# Altium project Ramp-generator.PrjPcb
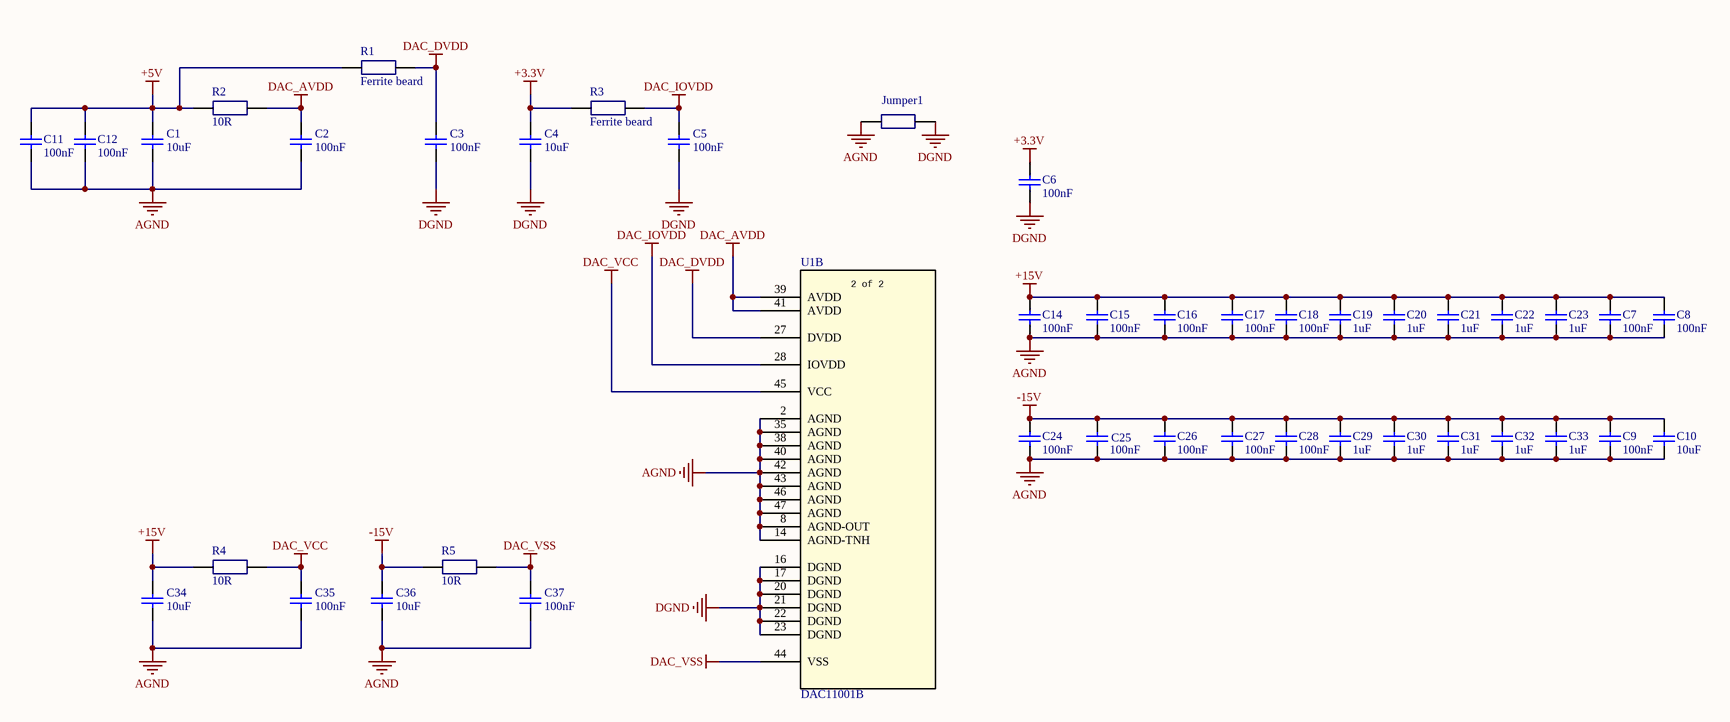
[diagram p0: shcematics.SchDoc]
2 sheets, 72 parts. Net scope: global (net labels, ports and power ports of the same name join across sheets).
Board file: 4layer_main_board.PcbDoc
Sheets:
  shcematics.SchDoc
  v2.SchDoc

## Sheet shcematics.SchDoc: Ultra-Precision low speed ramp generator for low current calibration
size A2; PageSetup: Record=PageOptions|CenterHorizontal=True|CenterVertical=True|PrintScale=0.52|XCorrection=1.00|YCorrection=1.00|PrintKind=0|BorderSize=5000000|LeftOffset=0|BottomOffset=0|Orientation=2|PaperLength=1000|PaperWidth=1000|Scale=100|PaperSource=7|PrintQuality=-3|MediaType=1|DitherType=10|PrintScaleMode=1|PaperKind=A4|PaperIndex=9

### Parts
C1  10uF  [CAP 0603]
C2  100nF  [CAP 0603]
C3  100nF  [CAP 0603]
C4  10uF  [CAP 0603]
C5  100nF  [CAP 0603]
C6  100nF  [CAP 0603]
C7  100nF  [CAP 0603]
C8  100nF  [CAP 0603]
C9  100nF  [CAP 0603]
C10  10uF  [CAP 0603]
C11  100nF  [CAP 0603]
C12  100nF  [CAP 0603]
C14  100nF  [CAP 0603]
C15  100nF  [CAP 0603]
C16  100nF  [CAP 0603]
C17  100nF  [CAP 0603]
C18  100nF  [CAP 0603]
C19  1uF  [CAP 0603]
C20  1uF  [CAP 0603]
C21  1uF  [CAP 0603]
C22  1uF  [CAP 0603]
C23  1uF  [CAP 0603]
C24  100nF  [CAP 0603]
C25  100nF  [CAP 0603]
C26  100nF  [CAP 0603]
C27  100nF  [CAP 0603]
C28  100nF  [CAP 0603]
C29  1uF  [CAP 0603]
C30  1uF  [CAP 0603]
C31  1uF  [CAP 0603]
C32  1uF  [CAP 0603]
C33  1uF  [CAP 0603]
C34  10uF  [C1206]
C35  100nF  [CAP 0603]
C36  10uF  [C1206]
C37  100nF  [CAP 0603]
Jumper1  (no value)  [0402 jumper]  (net tie, no BOM)
R1  Ferrite beard  [CC1206JRNPOBBN100]
R2  10R  [1608[0603]]
R3  Ferrite beard  [CC1206JRNPOBBN100]
R4  10R  [1608[0603]]
R5  10R  [1608[0603]]
U1  DAC11001B  [QFP_APFBR_TEX]  (part B of 2)

### Nets
+3.3V: C4.1 C6.2 R3.2
+5V: C1.1 C11.2 C12.2 R1.2 R2.2
+15V: C7.2 C8.2 C14.2 C15.2 C16.2 C17.2 C18.2 C19.2 C20.2 C21.2 C22.2 C23.2 C34.1 R4.2
-15V: C9.2 C10.2 C24.2 C25.2 C26.2 C27.2 C28.2 C29.2 C30.2 C31.2 C32.2 C33.2 C36.1 R5.2
AGND: C1.2 C2.2 C7.1 C8.1 C9.1 C10.1 C11.1 C12.1 C14.1 C15.1 C16.1 C17.1 C18.1 C19.1 C20.1 C21.1 C22.1 C23.1 C24.1 C25.1 C26.1 C27.1 C28.1 C29.1 C30.1 C31.1 C32.1 C33.1 C34.2 C35.2 C36.2 C37.2 Jumper1.2 U1.2(AGND) U1.8(AGND-OUT) U1.14(AGND-TNH) U1.35(AGND) U1.38(AGND) U1.40(AGND) U1.42(AGND) U1.43(AGND) U1.46(AGND) U1.47(AGND)
DAC_AVDD: C2.1 R2.1(A) U1.39(AVDD) U1.41(AVDD)
DAC_DVDD: C3.1 R1.1(A) U1.27(DVDD)
DAC_IOVDD: C5.1 R3.1(A) U1.28(IOVDD)
DAC_VCC: C35.1 R4.1(A) U1.45(VCC)
DAC_VSS: C37.1 R5.1(A) U1.44(VSS)
DGND: C3.2 C4.2 C5.2 C6.1 Jumper1.1(A) U1.16(DGND) U1.17(DGND) U1.20(DGND) U1.21(DGND) U1.22(DGND) U1.23(DGND)

### Notes on the sheet
- (in symbol DAC11001APFBR, part B) 2 of 2

### Library data of the parts
C1-C12 C14-C37 = Cap Semi: Capacitor (Semiconductor SIM Model); Order: CC0603KRX7R8BB104; Published: 8-Jun-2000; LatestRevisionDate: 29-May-2009; LatestRevisionNote: IPC-7351 Footprint Added.; PackageReference: C1206; Publisher: Altium Limited; PackageDescription: Chip Capacitor
  C1 C4 C10 C34 C36: Value: 10uF
  C2 C3 C5-C9 C11 C12 C14-C18 C24-C28 C35 C37: Value: 100nF
  C19-C23 C29-C33: Value: 1uF
Jumper1 = Resistor 0805: Avail: 20
R1-R5 = Resistor 0805: Order: ERA-3AEB4992V; Avail: 20
  R1 R3: Value: Ferrite beard
  R2 R4 R5: Value: 10R
U1 = DAC11001APFBR: No Description Available; Vendor: Texas Instruments; Built_By: EMA_Matt; SourceLibrary: Texas_Instruments_2020-07-20; Manufacturer_Part_Number: DAC11001APFBR; Copyright: Copyright (C) 2018 Accelerated Designs. All rights reserved; Datasheet: https://www.ti.com/lit/ds/symlink/dac11001a.pdf; RefDes: RefDes; Type: DEV

## Sheet v2.SchDoc
size A3
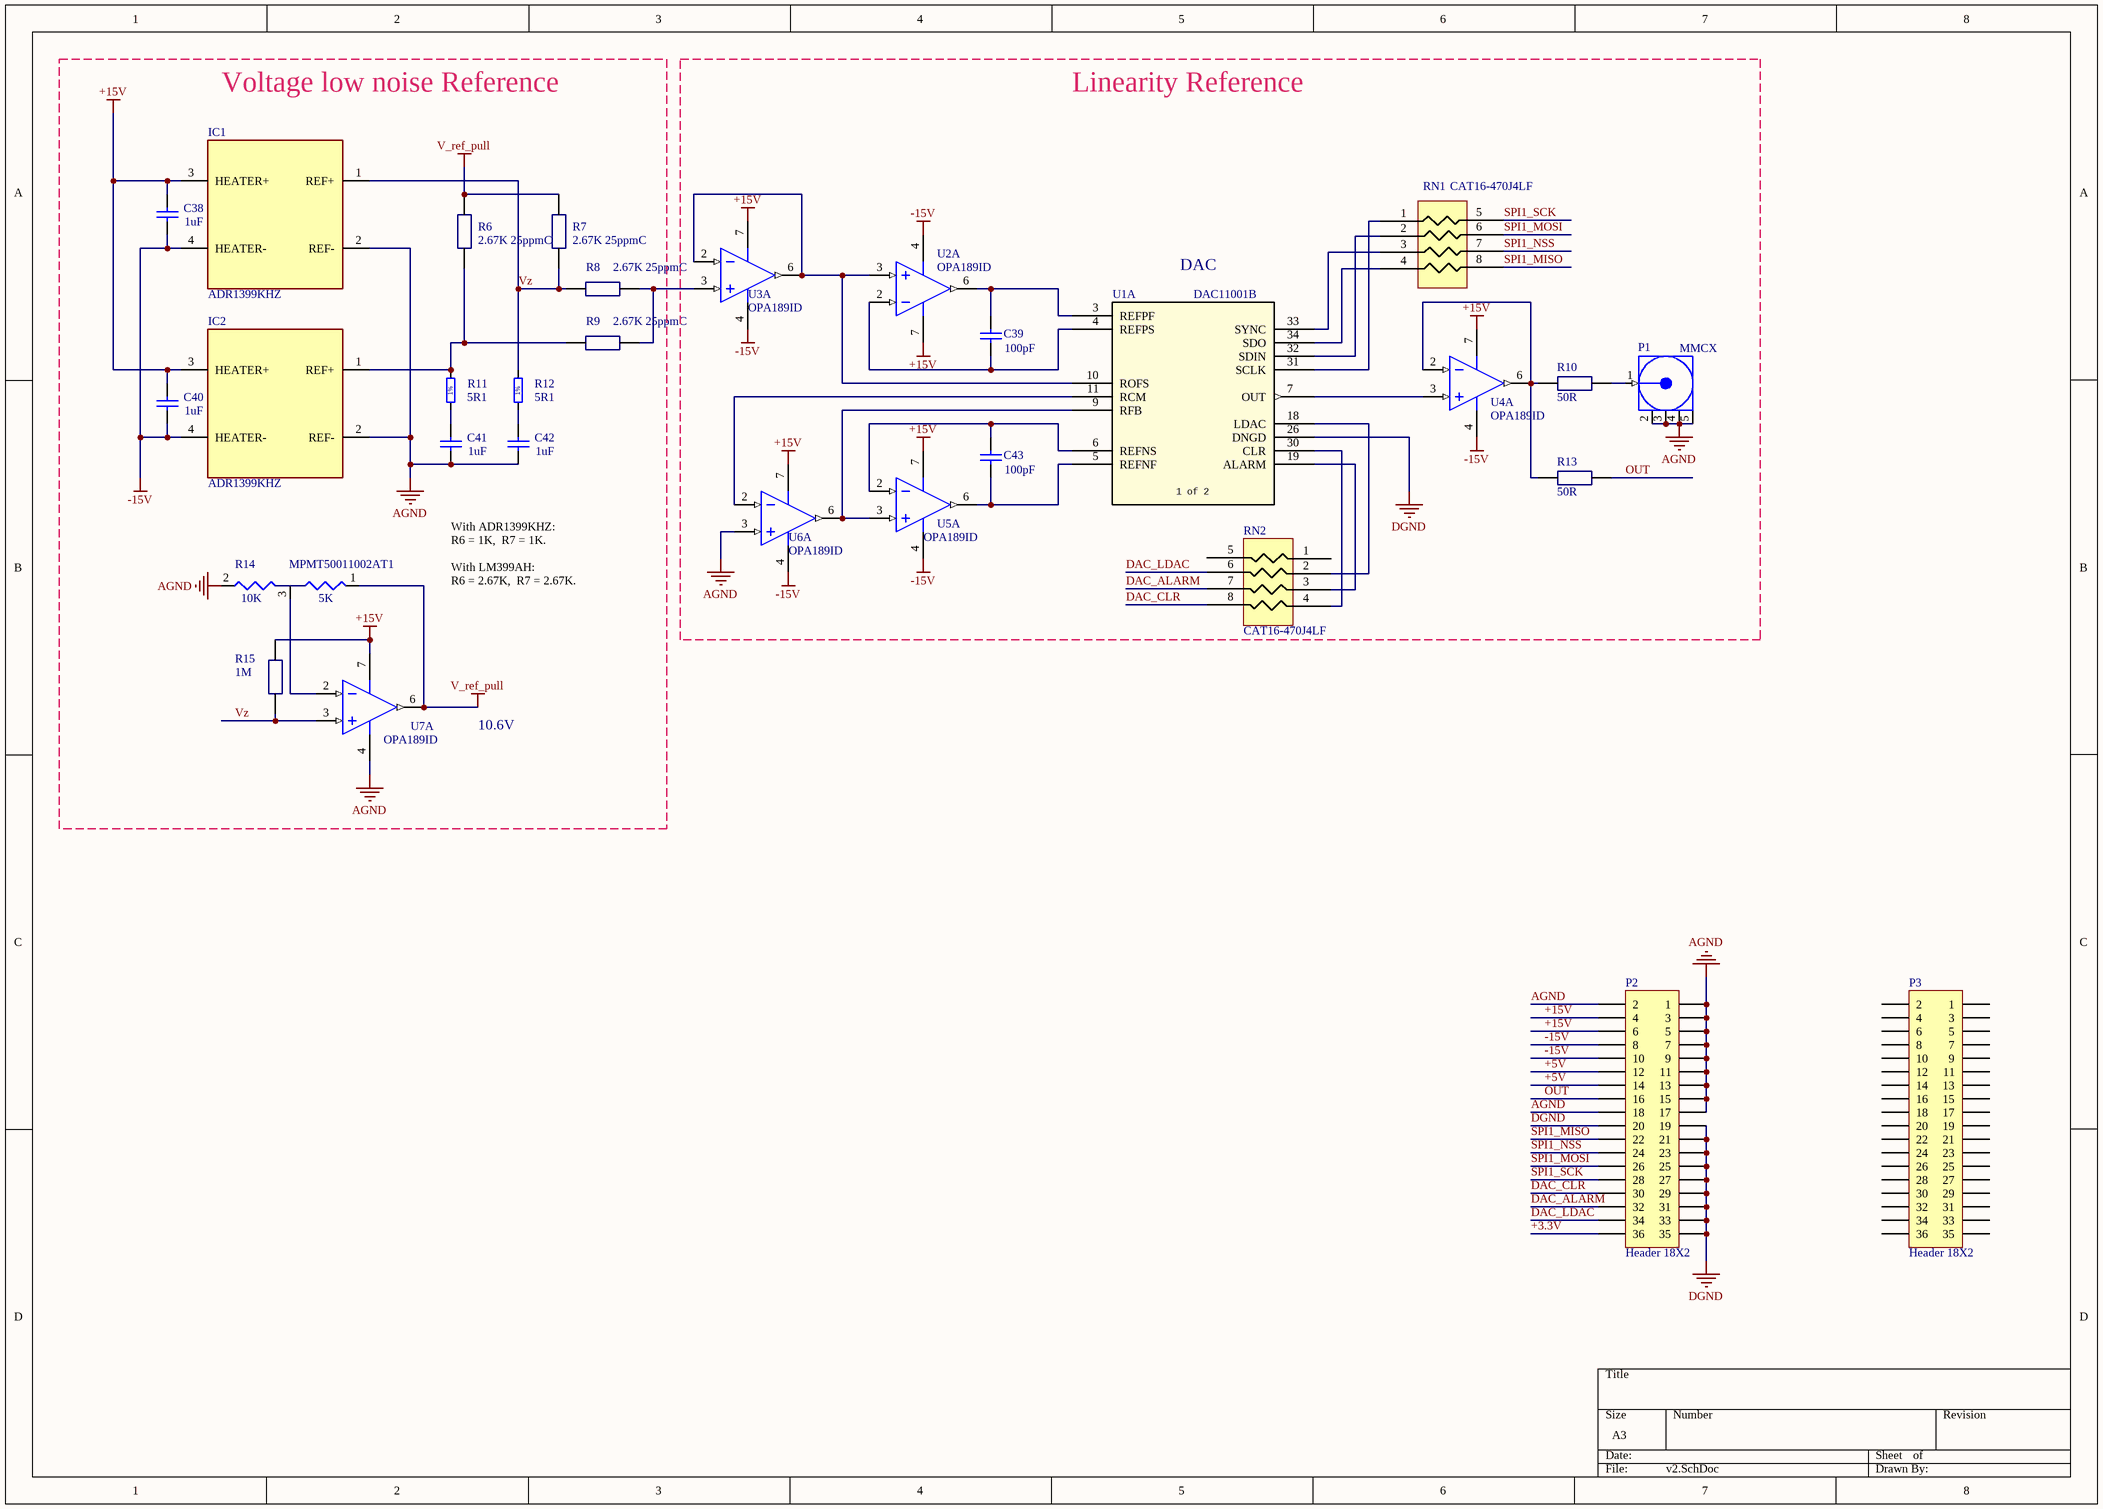
[diagram p1: v2.SchDoc]

### Parts
C38  1uF  [CAPC3216X140N]
C39  value 100pF  [0402]  (hidden comment: Cap Semi)
C40  1uF  [CAPC3216X140N]
C41  1uF  [CAPC3216X140N]
C42  1uF  [CAPC3216X140N]
C43  value 100pF  [0402]  (hidden comment: Cap Semi)
IC1  ADR1399KHZ  [ADR1399KHZ]
IC2  ADR1399KHZ  [ADR1399KHZ]
P1  MMCX  [MMCX2.54-V5]
P2  Header 18X2  [HDR2X18]
P3  Header 18X2  [HDR2X18]
R6  2.67K 25ppmC  [1608[0603]]
R7  2.67K 25ppmC  [1608[0603]]
R8  2.67K 25ppmC  [1608[0603]]
R9  2.67K 25ppmC  [1608[0603]]
R10  50R  [1608[0603]]
R11  5R1  [RESC3216X65N]
R12  5R1  [RESC3216X65N]
R13  50R  [1608[0603]]
R14  value 5K  Value2: 10K  [SOT23-3]  (hidden comment: MPMT50011002AT1)
R15  1M  [1608[0603]]
RN1  CAT16-470J4LF  [CAT16-470J4LF]
RN2  CAT16-470J4LF  [CAT16-470J4LF]
U1  DAC11001B  [QFP_APFBR_TEX]  (part A of 2)
U2  OPA189ID  [TI-D8_L]  (part A of 2)
U3  OPA189ID  [TI-D8_L]  (part A of 2)
U4  OPA189ID  [TI-D8_L]  (part A of 2)
U5  OPA189ID  [TI-D8_L]  (part A of 2)
U6  OPA189ID  [TI-D8_L]  (part A of 2)
U7  OPA189ID  [TI-D8_L]  (part A of 2)

### Blocks framed on the sheet
Voltage low noise Reference: C38 C40-C42 IC1 IC2 R6-R9 R11 R12 R14 R15 U7
Linearity Reference: C39 C43 P1 R10 R13 RN1 RN2 U1-U6

### Nets
+3.3V: P2.36
+5V: P2.12 P2.14
+15V: C38.2 C40.2 IC1.3(HEATER+) IC2.3(HEATER+) P2.4 P2.6 R15.1(A) U2.7(V+) U3.7(V+) U4.7(V+) U5.7(V+) U6.7(V+) U7.7(V+)
-15V: C38.1 C40.1 IC1.4(HEATER-) IC2.4(HEATER-) P2.8 P2.10 U2.4(V-) U3.4(V-) U4.4(V-) U5.4(V-) U6.4(V-)
AGND: C41.1 C42.1 IC1.2(REF-) IC2.2(REF-) P1.2(GND) P1.3(GND) P1.4(GND) P1.5(GND) P2.1 P2.2 P2.3 P2.5 P2.7 P2.9 P2.11 P2.13 P2.15 P2.17 P2.18 R14.2 U6.3(IN+) U7.4(V-)
DGND: P2.19 P2.20 P2.21 P2.23 P2.25 P2.27 P2.29 P2.31 P2.33 P2.35 U1.26(DNGD)
V_ref_pull: R6.1(A) R7.1(A) R14.1 U7.6(OUT)
DAC_ALARM: P2.32 RN2.7
DAC_CLR: P2.30 RN2.8
DAC_LDAC: P2.34 RN2.6
OUT: P2.16 R13.1(A)
SPI1_MISO: P2.22 RN1.8
SPI1_MOSI: P2.26 RN1.6
SPI1_NSS: P2.24 RN1.7
SPI1_SCK: P2.28 RN1.5
Vz: IC1.1(REF+) R7.2 R8.2 R12.2 R15.2 U7.3(IN+)
NetC39_1: C39.1 U1.4(REFPS) U2.2(IN-)
NetC39_2: C39.2 U1.3(REFPF) U2.6(OUT)
NetC41_2: C41.2 R11.1
NetC42_2: C42.2 R12.1
NetC43_1: C43.1 U1.5(REFNF) U5.6(OUT)
NetC43_2: C43.2 U1.6(REFNS) U5.2(IN-)
NetIC2_1: IC2.1(REF+) R6.2 R9.2 R11.2
NetP1_1: P1.1(Signal) R10.1(A)
NetR8_1: R8.1(A) R9.1(A) U3.3(IN+)
NetR10_2: R10.2 R13.2 U4.2(IN-) U4.6(OUT)
NetR14_3: R14.3 U7.2(IN-)
NetRN1_1: RN1.1 U1.31(SCLK)
NetRN1_2: RN1.2 U1.32(SDIN)
NetRN1_3: RN1.3 U1.33(SYNC)
NetRN1_4: RN1.4 U1.34(SDO)
NetRN2_2: RN2.2 U1.18(LDAC)
NetRN2_3: RN2.3 U1.19(ALARM)
NetRN2_4: RN2.4 U1.30(CLR)
NetU1_7: U1.7(OUT) U4.3(IN+)
NetU1_9: U1.9(RFB) U5.3(IN+) U6.6(OUT)
NetU1_10: U1.10(ROFS) U2.3(IN+) U3.2(IN-) U3.6(OUT)
NetU1_11: U1.11(RCM) U6.2(IN-)

Not connected (* = marked no-connect by the designer): P3 1 2 3 4 5 6 7 8 9 10 11 12 13 14 15 16 17 18 19 20 21 22 23 24 25 26 27 28 29 30 31 32 33 34 35 36; RN2 1 5

### Notes on the sheet
- (near U1) DAC
- With ADR1399KHZ:
  R6 = 1K,  R7 = 1K.
  With LM399AH:
  R6 = 2.67K,  R7 = 2.67K.
- 10.6V
- (in symbol DAC11001APFBR, part A) 1 of 2
- (in symbol R1206_5R6_1%_0.25W_200PPM) 1%

### Library data of the parts
C38 C40-C42 = CC1206_1UF_25V_10%_X7R: Non-polarised capacitor; Part Description: SMD Multilayer Chip Ceramic Capacitor; Manufacturer: GENERIC; Manufacturer1 Part Number: C1206C105K3RAC; Voltage: 25V; TC: X7R; Tolerance: ±10%; Part Number: CC1206_1UF_25V_10%_X7R; Component Kind: Standard; Component Type: Standard; Pin Count: 2; Value: 1uF; Status: Preferred; Manufacturer Part Number: CC1206_1UF_25V_10%_X7R; Case: 1206; Mounted: Yes; Socket: No; SMD: Yes; Sense: No; Manufacturer1 Example: KEMET; Manufacturer1 ComponentHeight: 1.75mm; HelpURL: \\cern.ch\dfs\Applications\Altium\Datasheets\CC1206_X7R_KEMET.pdf; Author: CERN DEM JLC; CreateDate: 03.12.2007; LatestRevisionDate: 03.12.2007
C39 C43 = Cap Semi: Capacitor (Semiconductor SIM Model); Published: 8-Jun-2000; LatestRevisionDate: 29-May-2009; LatestRevisionNote: IPC-7351 Footprint Added.; PackageReference: C1206; Publisher: Altium Limited; PackageDescription: Chip Capacitor
IC1 IC2 = ADR1399KHZ: Integrated Circuit; Manufacturer_Name: Analog Devices; Datasheet Link: https://www.analog.com/media/en/technical-documentation/data-sheets/adr1399.pdf; Height: 2.667mm; Manufacturer_Part_Number: ADR1399KHZ
P1 = COAX-M: RF Coaxial PCB Connector, MMCX; Thru-Hole, Vertical Mount Plug,  50 Ohm Impedance; PackageDocument: Rev. A, 16-Jun-1997; PCB_Layout: Complies with manufacturer's recommendation.; DrillSize: Corresponds to nominal value.; Published: 15-Jul-2004; LatestRevisionDate: 15-Jul-2004; LatestRevisionNote: Component Replaced.; DatasheetDocument: 30-May-2003; PackageReference: 908-21103; Publisher: Altium Limited; ComponentLink1Description: Manufacturer Link; ComponentLink1URL: http://www.amphenolrf.com/
P2 P3 = Header 18X2: Header, 18-Pin, Dual row; LatestRevisionDate: 17-Jul-2002; LatestRevisionNote: Re-released for DXP Platform.; Publisher: Altium Limited
R6 R7 R15 = Resistor 0805: Order: ERA-3AEB49R9V; Avail: 20; BOM Order: ERA-3AEB2671V
  R6 R7: Value: 2.67K 25ppmC
  R15: Value: 1M
R8-R10 R13 = Resistor 0805: Order: ERA-3AEB49R9V; Avail: 20
  R8 R9: Value: 2.67K 25ppmC
  R10 R13: Value: 50R
R11 R12 = R1206_5R6_1%_0.25W_200PPM: Resistor - 1%; Part Description: General Purpose Thick Film Chip Resistor; Manufacturer: GENERIC; Manufacturer1 Part Number: 232272465608L or RC1206FR-075R6L; Power: 0.25W; TC: ±200ppm/°C; PressFit: No; Part Number: R1206_5R6_1%_0.25W_200PPM; Component Kind: Standard; Component Type: Standard; Pin Count: 2; Value: 5R1; Status: Preferred; Tolerance: ±1%; Manufacturer Part Number: R1206_5R6_1%_0.25W_200PPM; Case: 1206; Mounted: Yes; Sense: No; Socket: No; SMD: Yes; Manufacturer1 Example: YAGEO PHYCOMP; Manufacturer1 ComponentHeight: 0.65mm; HelpURL: \\cern.ch\dfs\Applications\Altium\Datasheets\R1206_Phycomp_RC1206.pdf; Author: CERN DEM JLC; CreateDate: 24.06.2009; LatestRevisionDate: 17.10.2012
R14 = MPMT: Published: 8-Jun-2000; LatestRevisionDate: 29-May-2009; LatestRevisionNote: IPC-7351 Footprint Added.; PackageReference: J1-0603; Publisher: Altium Limited; PackageDescription: Chip Resistor; Order: MPMT50011002AT1
U1 = DAC11001APFBR: as U1 on sheet shcematics; Manufacturer_Part_Number: DAC11001APFBR; Copyright: Copyright (C) 2018 Accelerated Designs. All rights reserved; Datasheet: https://www.ti.com/lit/ds/symlink/dac11001a.pdf; RefDes: RefDes; Type: DEV
U2-U7 = OPA140AIDR: 11 MHz, Single Supply, Low Noise, Precision, Rail-to-Rail Output, JFET Amplifier, 4.5 to 36 V, -40 to 125 degC, 8-pin SOIC (D8), Green (RoHS & no Sb/Br); Manufacturer: Texas Instruments; CMRR(Min)(dB): 126; GBW(Typ)(MHz): 11; IIB(Max)(pA): 10; Iq per channel(Max)(mA): 2; Number of Channels: 1; Offset Drift(Typ)(uV/C): 0.35; Packing: LARGE T&R; Rating: Catalog; Slew Rate(Typ)(V/us): 20; Sub Family: High Supply Voltage Amplifier (>=30V), Low Input Bias Current Amp (<=10pA), Low Noise Amp (<=10nV/rtHz), Low Offset Voltage Amplifier (<=500uV), Precision Amplifier; Total Supply Voltage(Max)(+5V is 5, +/-5V is 10): 36; Total Supply Voltage(Min)(+5V is 5, +/-5V is 10): 4.5; Vio (25C)(Max)(mV): 0.12; DatasheetVersion: SBOS498A; PackageVersion: 4040047-3/M, 06/2011; PackageReference: D8; PackageDescription: 8-Pin Plastic Small Outline, Body 4.9 x 3.9 mm, Pitch 1.27 mm; Supplier 1: Digi-Key; Supplier Part Number 1: OPA140AIDR-ND; Supplier 2: Newark; Supplier Part Number 2: 21T3836; Supplier 3: Mouser; Supplier Part Number 3: 595-OPA140AIDR; Eco-Plan: Green (RoHS & no Sb/Br); Mounting Technology: Surface Mount; Code_JEDEC: MS-012; PartNumber: OPA189ID; ComponentLink1Description: Manufacturer URL; ComponentLink1URL: http://www.ti.com/; ComponentLink2Description: Datasheet; ComponentLink2URL: http://www.ti.com/lit/ds/symlink/opa140.pdf; ComponentLink3Description: Package Specification; ComponentLink3URL: http://www.ti.com/litv/pdf/msoi002j

## Nets that join several sheets
+3.3V: shcematics (C4.1 C6.2 R3.2), v2 (P2.36)
+5V: shcematics (5 pins), v2 (P2.12 P2.14)
+15V: shcematics (14 pins), v2 (13 pins)
-15V: shcematics (14 pins), v2 (11 pins)
AGND: shcematics (43 pins), v2 (22 pins)
DGND: shcematics (11 pins), v2 (11 pins)